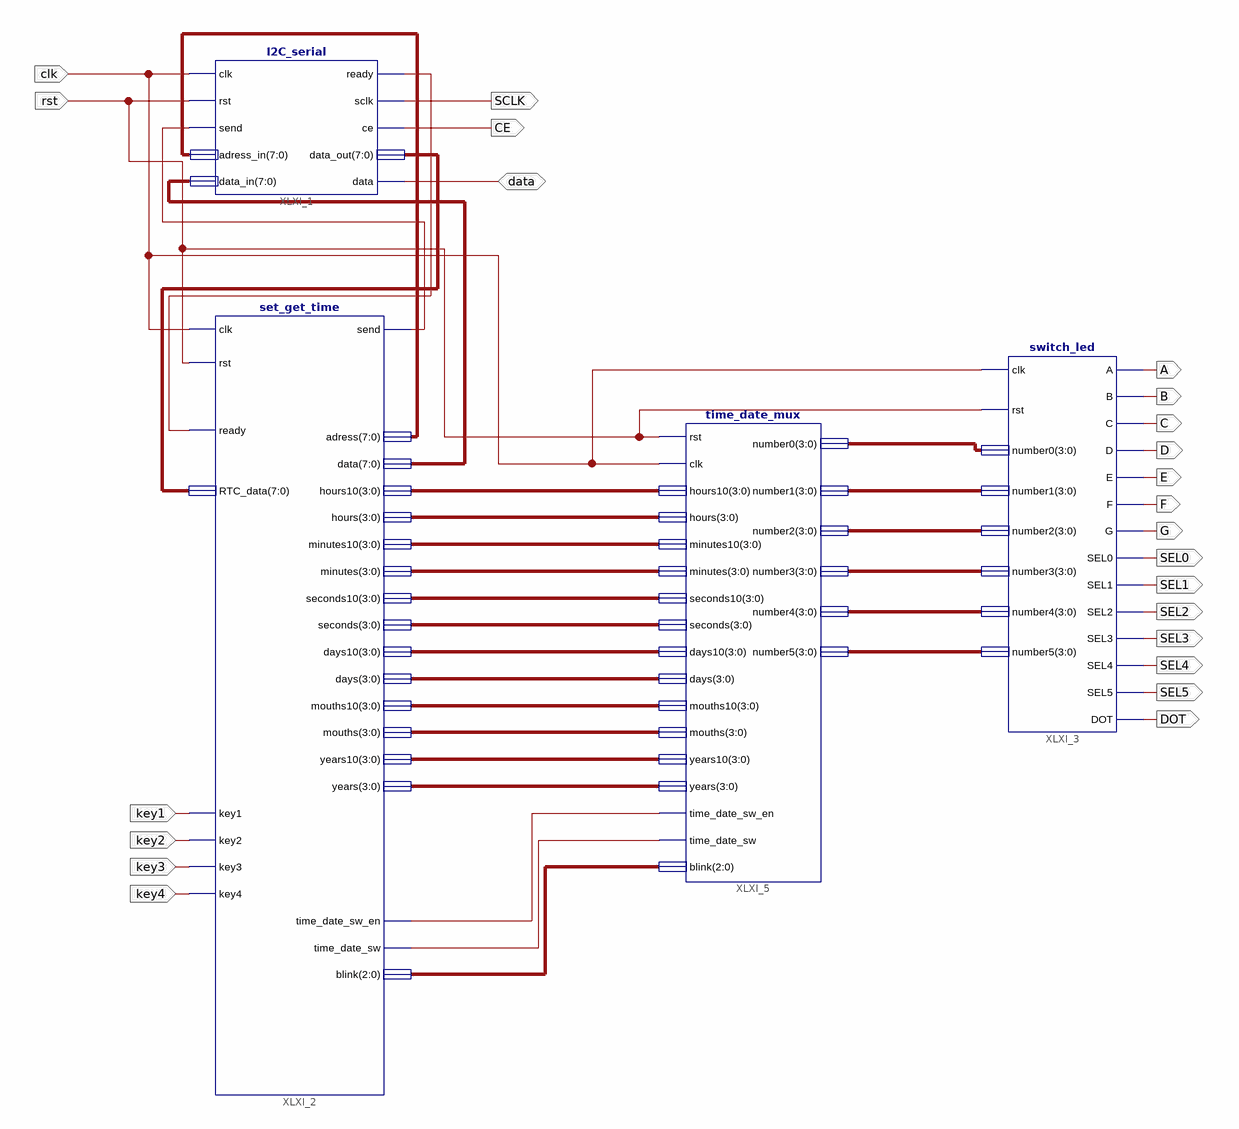
[diagram p0: schematic sheet 1]
// Xilinx ISE schematic schematic.sch (spartan6) as structural Verilog: 4 symbols, 23 ports
module schematic (
  input  clk,
  input  rst,
  input  key1,
  input  key2,
  input  key3,
  input  key4,
  inout  data,
  output SCLK,
  output CE,
  output A,
  output B,
  output C,
  output D,
  output E,
  output F,
  output G,
  output SEL0,
  output SEL1,
  output SEL2,
  output SEL3,
  output SEL4,
  output SEL5,
  output DOT
);

  wire XLXN_21, XLXN_24, XLXN_67, XLXN_68;
  wire [2:0] XLXN_69;
  wire [3:0] XLXN_1, XLXN_2, XLXN_3, XLXN_4, XLXN_5, XLXN_7, XLXN_8, XLXN_9, XLXN_10, XLXN_11, XLXN_12,
       XLXN_13, XLXN_14, XLXN_15, XLXN_16, XLXN_17, XLXN_18, XLXN_19;
  wire [7:0] XLXN_20, XLXN_27, XLXN_34;

  I2C_serial XLXI_1 (
    .ready(XLXN_21), .sclk(SCLK), .ce(CE), .data_out(XLXN_20), .data(data), .clk(clk), .rst(rst),
    .send(XLXN_24), .adress_in(XLXN_34), .data_in(XLXN_27));
  set_get_time XLXI_2 (
    .clk(clk), .rst(rst), .key1(key1), .key2(key2), .key3(key3), .key4(key4), .ready(XLXN_21),
    .RTC_data(XLXN_20), .send(XLXN_24), .adress(XLXN_34), .data(XLXN_27), .hours10(XLXN_8), .hours(XLXN_9),
    .minutes10(XLXN_10), .minutes(XLXN_11), .seconds10(XLXN_12), .seconds(XLXN_13), .days10(XLXN_14),
    .days(XLXN_15), .mouths10(XLXN_16), .mouths(XLXN_17), .years10(XLXN_18), .years(XLXN_19),
    .time_date_sw_en(XLXN_67), .time_date_sw(XLXN_68), .blink(XLXN_69));
  switch_led XLXI_3 (
    .clk(clk), .rst(rst), .number0(XLXN_1), .number1(XLXN_2), .number2(XLXN_3), .number3(XLXN_4),
    .number4(XLXN_5), .number5(XLXN_7), .A(A), .B(B), .C(C), .D(D), .E(E), .F(F), .G(G), .SEL0(SEL0),
    .SEL1(SEL1), .SEL2(SEL2), .SEL3(SEL3), .SEL4(SEL4), .SEL5(SEL5), .DOT(DOT));
  time_date_mux XLXI_5 (
    .rst(rst), .clk(clk), .hours10(XLXN_8), .hours(XLXN_9), .minutes10(XLXN_10), .minutes(XLXN_11),
    .seconds10(XLXN_12), .seconds(XLXN_13), .days10(XLXN_14), .days(XLXN_15), .mouths10(XLXN_16),
    .mouths(XLXN_17), .years10(XLXN_18), .years(XLXN_19), .number0(XLXN_1), .number1(XLXN_2),
    .number2(XLXN_3), .number3(XLXN_4), .number4(XLXN_5), .number5(XLXN_7), .time_date_sw_en(XLXN_67),
    .time_date_sw(XLXN_68), .blink(XLXN_69));
endmodule
